# Altium schematic sheet 01-Antennas.SchDoc
size B; SheetNumber: 1; SheetTotal: 14; SPICEModelCacheELOCFEDZ: <root> / <DocumentId>ELOCFEDZ</DocumentId> / </root>
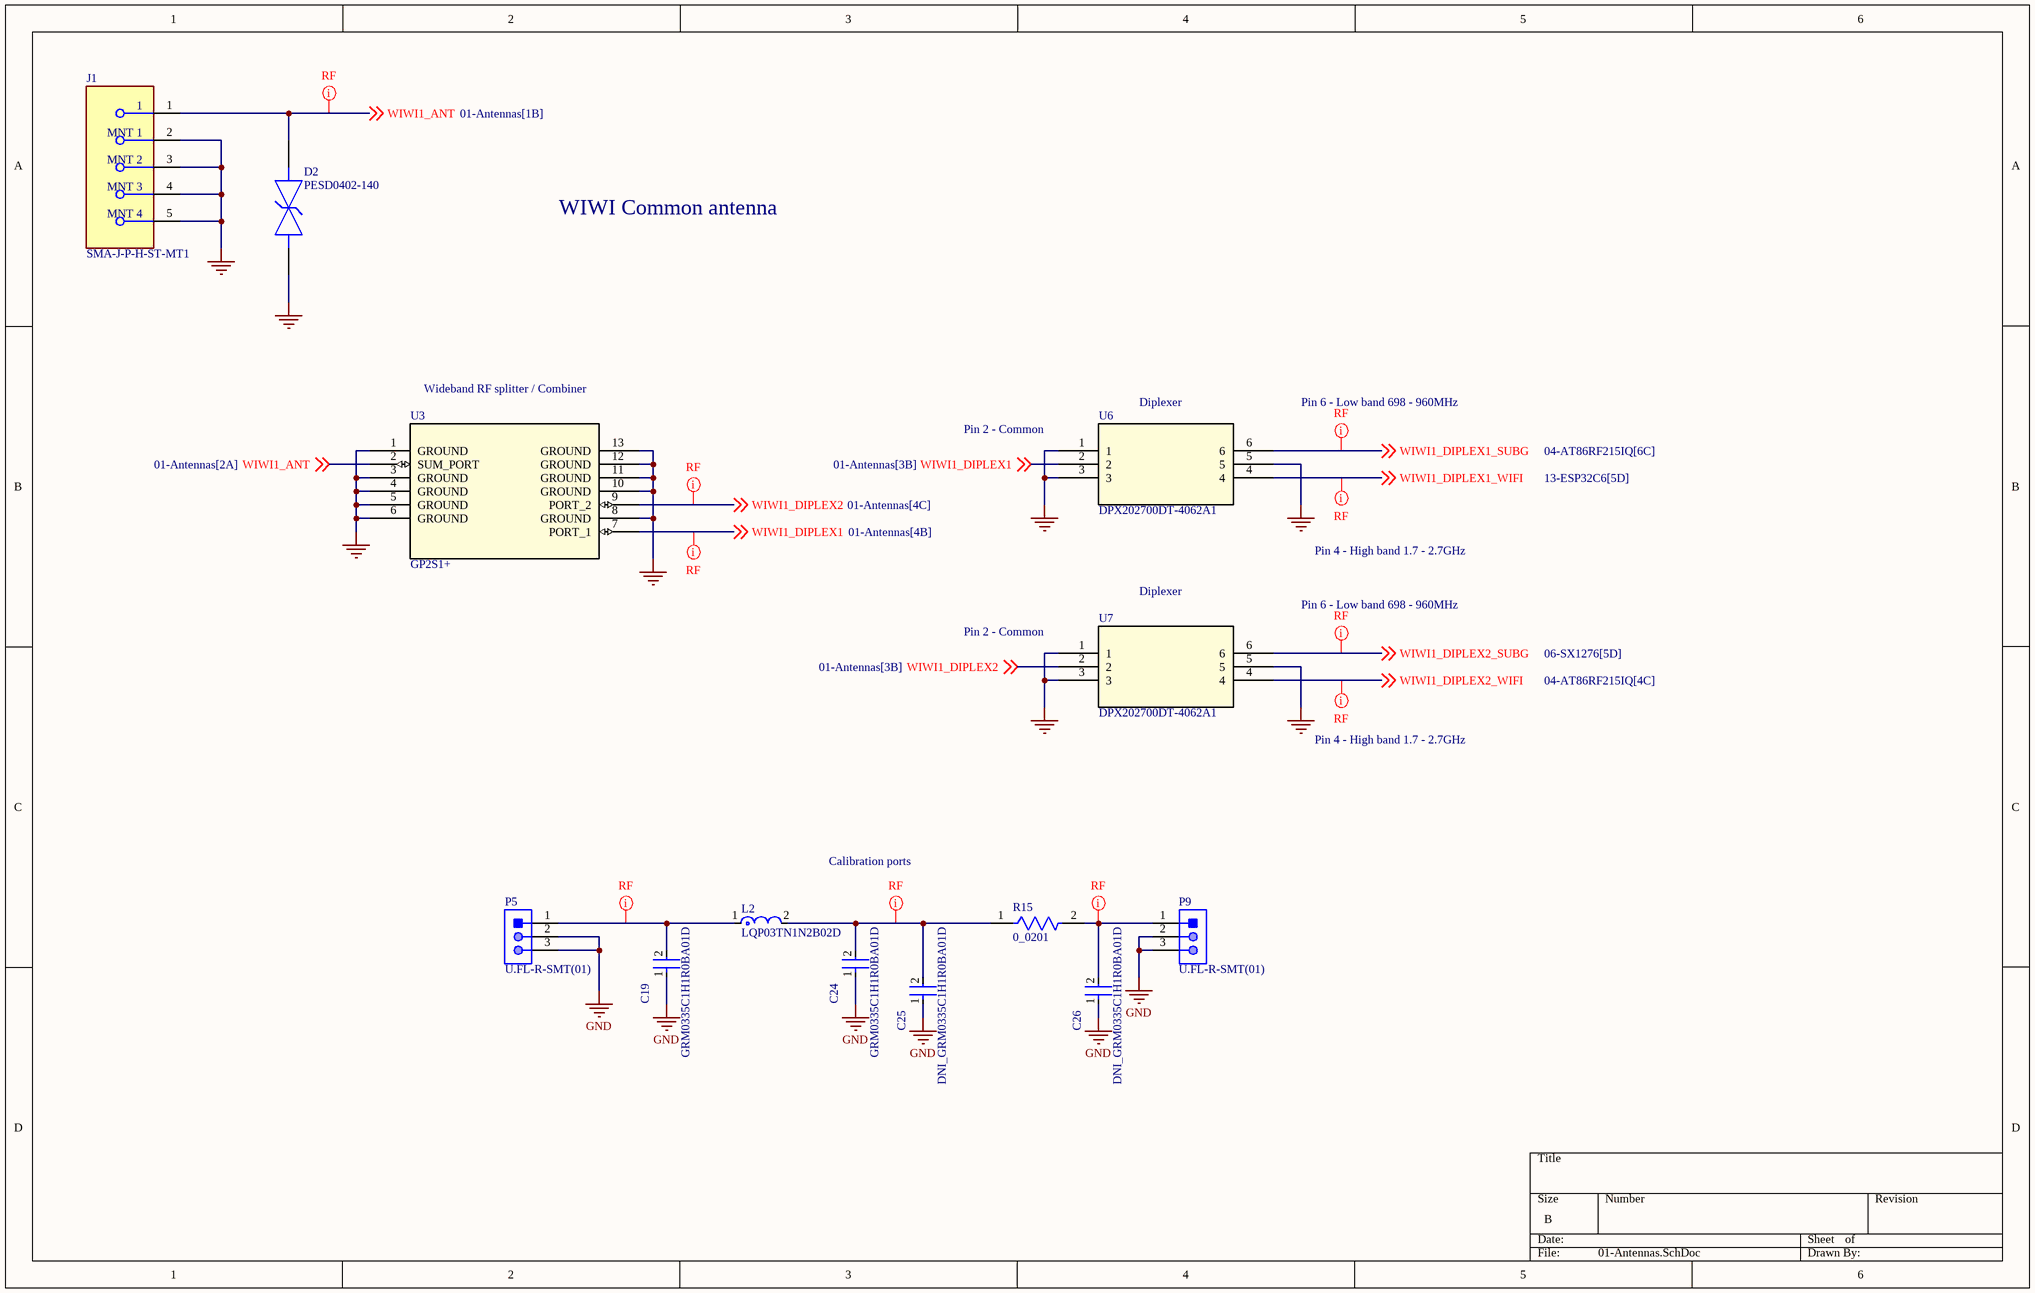
[diagram p0: 01-Antennas.SchDoc]

## Parts
C19  GRM0335C1H1R0BA01D  [FP-GRM033-0_03-IPC_C]
C24  GRM0335C1H1R0BA01D  [FP-GRM033-0_03-IPC_C]
C25  DNI_GRM0335C1H1R0BA01D  [FP-GRM033-0_03-IPC_C]  (no BOM)
C26  DNI_GRM0335C1H1R0BA01D  [FP-GRM033-0_03-IPC_C]  (no BOM)
D2  PESD0402-140  [FP-PESD0402-MFG]
J1  SMA-J-P-H-ST-MT1  [FP-SMA-J-P-H-ST-MT1-MFG]
L2  LQP03TN1N2B02D  [FP-LQP03TG_02-IPC_A]
P5  U.FL-R-SMT(01)  [HRS-U.FL-R-SMT(10)_V]
P9  U.FL-R-SMT(01)  [HRS-U.FL-R-SMT(10)_V]
R15  0_0201  [FP-RC_L0201-MFG]
U3  GP2S1+  [DQ1225_MNC]
U6  DPX202700DT-4062A1  [RF_4060A1_TDK]
U7  DPX202700DT-4062A1  [RF_4060A1_TDK]

## Nets
GND: C19.1 C24.1 C25.1 C26.1 D2.1 J1.2(MNT_1) J1.3(MNT_2) J1.4(MNT_3) J1.5(MNT_4) P5.2 P5.3 P9.2 P9.3 U3.1(GROUND) U3.3(GROUND) U3.4(GROUND) U3.5(GROUND) U3.6(GROUND) U3.8(GROUND) U3.10(GROUND) U3.11(GROUND) U3.12(GROUND) U3.13(GROUND) U6.1 U6.3 U6.5 U7.1 U7.3 U7.5
WIWI1_ANT: D2.2 J1.1 U3.2(SUM_PORT) ; off-sheet WIWI1_ANT
WIWI1_DIPLEX1: U3.7(PORT_1) U6.2 ; off-sheet WIWI1_DIPLEX1
WIWI1_DIPLEX1_SUBG: U6.6 ; off-sheet WIWI1_DIPLEX1_SUBG
WIWI1_DIPLEX1_WIFI: U6.4 ; off-sheet WIWI1_DIPLEX1_WIFI
WIWI1_DIPLEX2: U3.9(PORT_2) U7.2 ; off-sheet WIWI1_DIPLEX2
WIWI1_DIPLEX2_SUBG: U7.6 ; off-sheet WIWI1_DIPLEX2_SUBG
WIWI1_DIPLEX2_WIFI: U7.4 ; off-sheet WIWI1_DIPLEX2_WIFI
NetC19_2: C19.2 L2.1 P5.1
NetC24_2: C24.2 C25.2 L2.2 R15.1
NetC26_2: C26.2 P9.1 R15.2

## Layout directives
net class RF: NetC19_2, NetC24_2, NetC26_2, WIWI1_ANT, WIWI1_DIPLEX1, WIWI1_DIPLEX1_SUBG, WIWI1_DIPLEX1_WIFI, WIWI1_DIPLEX2, WIWI1_DIPLEX2_SUBG, WIWI1_DIPLEX2_WIFI

## Notes on the sheet
- WIWI Common antenna
- Wideband RF splitter / Combiner
- (near U6) Pin 2 - Common
- (near U6) Diplexer
- Pin 6 - Low band 698 - 960MHz
- Pin 4 - High band 1.7 - 2.7GHz
- (near U7) Pin 2 - Common
- Diplexer
- Calibration ports

## Library data of the parts
C19 C24-C26 = CMP-2010-01509-2: Chip Multilayer Ceramic Capacitors for General Purpose, 0201, 1.0pF, C0G, 30ppm/°C, 0.1pF, 50V; Capacitance: 1pF; Termination: SMD/SMT; Depth: 0.3mm; Mount: Surface Mount; Case Code (Metric): 0603; Length: 0.024inch; Voltage Rating: 50V; Voltage Rating (DC): 50V; Width: 0.012inch; Lead Free: Lead Free; Dielectric: C0G; Thickness: 0.013inch; Packaging: Tape and Reel; Case Code (Imperial): 0201; Case/Package: 0201; Package Quantity: 15000; Min Operating Temperature: -55°C; Max Operating Temperature: 125°C
D2 = CMP-08607-000011-1: TVS DIODE 14V 40V 0402; Manufacturer: Littelfuse Inc.; Automotive Grade: Grade 1; Capacitance: 0.25pF; Value: 0.25pF; Direction: Bidirectional; Number Of Channels: 1; Temperature Range Low: -55°C; Lead Free: Yes; Temperature: -55°C to +125°C; Digikey Description: TVS DIODE 14V 40V 0402; Automotive: Yes; Device Class L2: TVS Diodes; Reverse Standoff Voltage: 14V; Device Class L1: Circuit Protection; Ipc Land Pattern Name: DIOC10050X33; Manufacturer Part Number: PESD0402-140; Breakdown Voltage: 14V; Height: 0.43mm; Clamping Voltage: 40V; RoHS: TRUE; Temperature Range High: +125°C; Device Class L3: unset; Octopart: https://octopart.com/pesd0402-140-littelfuse-74215061; Package: PESD0402; ComponentLink2URL: https://www.littelfuse.com/~/media/electronics/datasheets/polymer_esd_suppressors/littelfuse_polymer_esd_suppressor_pesd_catalog_datasheet.pdf.pdf; Category: Diode; ComponentLink2Description: Datasheet
J1 = CMP-02754-000007-1: CONN SMA JACK STR 50 OHM SMD; Dielectric Material: PTFE; Voltage Rating: 335V; Body Material: Brass; Center Contact Plating: Gold; Impedance: 50R; Number of Ports: 1; Max Frequency: 20GHz; Mount: Surface Mount; Contact Plating: Gold; Housing Color: Gold; Series: -; Fastening Type: Threaded; Packaging: Bulk; Connector Type: SMA; Contact Material: Copper Alloy; Body Plating: Gold; Case/Package: SMA; Termination: Solder; RoHS Compliant: No; Min Operating Temperature: -65°C; Max Operating Temperature: 125°C
L2 = CMP-06042-001577-1: Film type RF Inductor 1.2nH ±0.1nH 750mA 0.1Ω 0201 (0603); DC Resistance (DCR): 100mR; Current: 600mA; Core Material: Non-Magnetic; Shielding: Unshielded; Q Factor: 14; Test Frequency: 500MHz; Self Resonant Frequency: 6GHz; Inductance: 1.2nH; Mount: Surface Mount; Package Quantity: 15000; Length: 0.024inch; Resistor Type: Thin Film; Min Operating Temperature: -55°C; Depth: 0.33mm; Height: 0.012inch; Max DC Current: 750mA; Width: 0.012inch; Case/Package: 0201; Case Code (Imperial): 0201; Lead Free: Lead Free; Military Standard: Not; Termination: SMD/SMT; Max Operating Temperature: 125°C; DC Current: 750mA; Packaging: Tape and Reel; Case Code (Metric): 0603; Height - Seated (Max): 0.013inch; REACH SVHC: No SVHC; Radiation Hardening: No; Current Rating: 750mA
P5 P9 = CMP-2000-05151-1: CONN RECPT ULTRA-MINI COAX SMD; Manufacturer: Hirose Electric; Centre Contact Resistance: 25mohm; Voltage Rating V AC: 60V; Female Contact Material: PhosphorBronze; Contact Resistance: 10mohm; Male Contact Material: Brass; Connector Type: UFLCoaxial; Connector Mounting: PCB; Impedance: 50ohm; Insulation Resistance: 500Mohm; Secondary Insulation Material: PBT; Frequency Max: 6GHz; Body Plating: Silver; External Length / Height: 2.5mm; Approval Category: UL94V-0; Female Contact Plating: Gold; Connector Mounting Orientation: PCBoard; VSWR: 1.3; Coaxial Termination: Solder; Body Style: StraightJack; SVHC: NoSVHC(18-Jun-2012); Jacket Material: LCP; Package Reference: U.FL-R-SMT(10); Datasheet Version: Feb-04; Outer Contact Resistance: 10mohm; Contact Plating: Gold; Mounting Type: PCBoard; Flammability Rating: UL94V-0; Operating Frequency Max: 6GHz; Termination Method: Solder; Male Contact Plating: Gold; Package Description: 3-Pin Surface Mount Device, Body 2.6 x 2.6 mm; Operating Temperature Min: -40degC; Manufacturer URL: https://www.hirose.com; Operating Temperature Max: 90degC; Contact Material: PhosphorBronze; Datasheet URL: http://www.farnell.com/datasheets/91524.pdf; Material: PhosphorBronze
R15 = CMP-03412-023265-1: RES SMD 0 OHM JUMPER 1/20W 0201; Manufacturer: Yageo; Manufacturer Part Number: RC0201JR-070RL; Power Rating: 50mW; Value: 0Ω; Temperature Coefficient: 200ppm/°C; Voltage Rating: 25V; Tolerance: 5%; Octopart: https://octopart.com/rc0201jr-070rl-yageo-43171986; ComponentLink2URL: http://www.yageo.com/documents/recent/PYu-RC_Group_51_RoHS_L_10.pdf; Device Class L2: Resistors; Series: RC_L; Ipc Land Pattern Name: RESC6030X23; Temperature: -55°C to +125°C; Mouser Description: Thick Film Resistors ZERO OHM JUMPER; Footprint Url: http://www.yageo.com/exep/pages/download/literatures/PYu-R_Mount_10.pdf; RoHS: TRUE; Package: RC_L0201; Device Class L3: Chip SMD Resistors; Temperature Range Low: -55°C; Composition: Thick Film; ComponentLink2Description: Datasheet; Height: 0.26mm; Device Class L1: Passive Components; Category: Res; Resistance: 0Ω; Temperature Range High: +125°C; Automotive: No; Lead Free: Yes; Digikey Description: RES SMD 0 OHM JUMPER 1/20W 0201
U3 = GP2S1+: No Description Available; Mfr_Name: Mini Circuits; Type: RF; RefDes: RefDes
U6 U7 = DPX202700DT-4062A1: No Description Available; Mfr_Name: TDK; RefDes: RefDes; Type: Type